# EAGLE design NixieTube_Daughterboard (EAGLE 9.6.2)
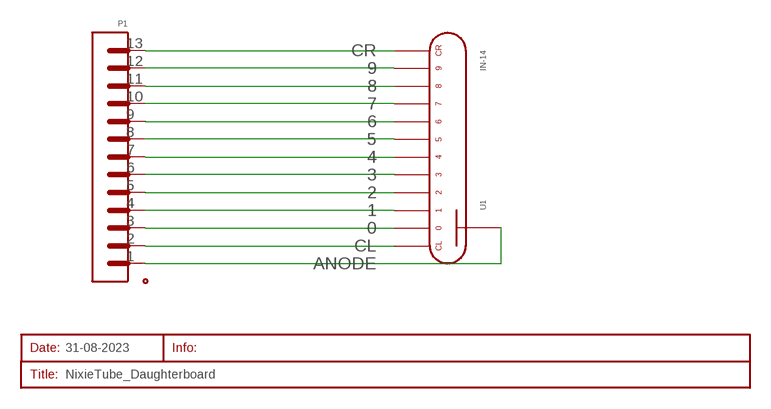
[diagram p0: schematic, sheet 1]

## Parts
P1  PORT_13-PIN_XH2.54  [XH2.54_13-PIN]
SCHEMATIC1  31-08-2023  SHEET  [SHEET]
U1  IN-14  NIXIE-TUBE_IN-14_TUBE  [NIXIE-TUBE_IN-14]

## Nets
0: P1.3 U1.1
1: P1.4 U1.2
2: P1.5 U1.3
3: P1.6 U1.4
4: P1.7 U1.5
5: P1.8 U1.6
6: P1.9 U1.7
7: P1.10 U1.8
8: P1.11 U1.9
9: P1.12 U1.0
ANODE: P1.1 U1.A(ANODE)
CL: P1.2 U1.C1
CR: P1.13 U1.C2

## Library data of the parts
P1 = myLibrary:PORT_13-PIN
SCHEMATIC1 = myLibrary:SHEET
U1 = myLibrary:NIXIE-TUBE_IN-14

## Board
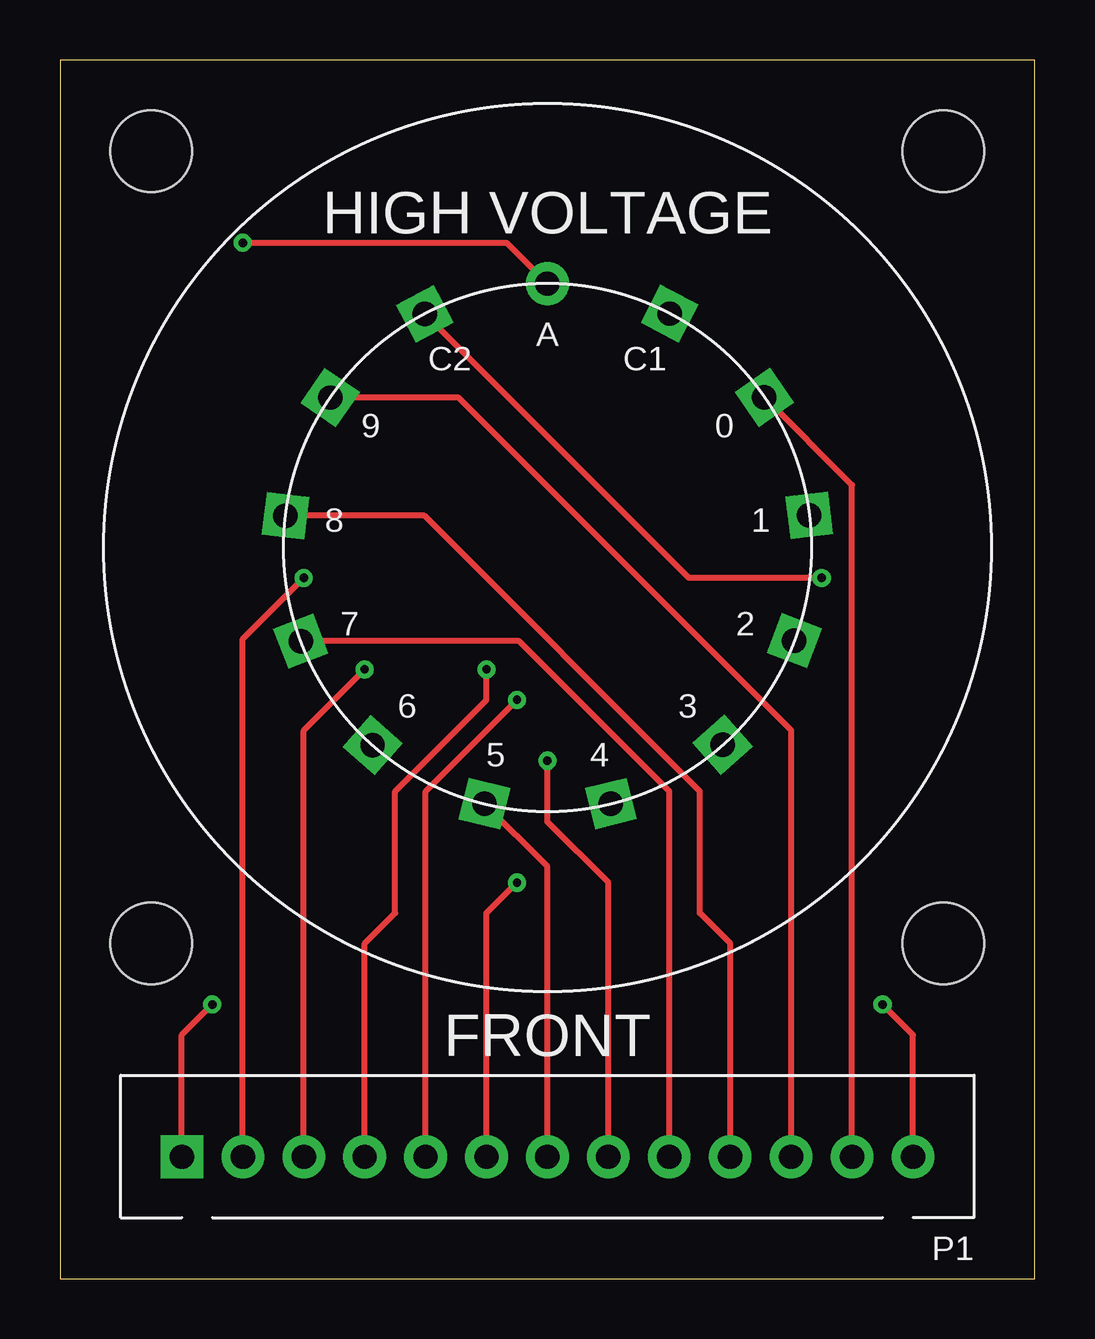
[diagram p1: board, top side]
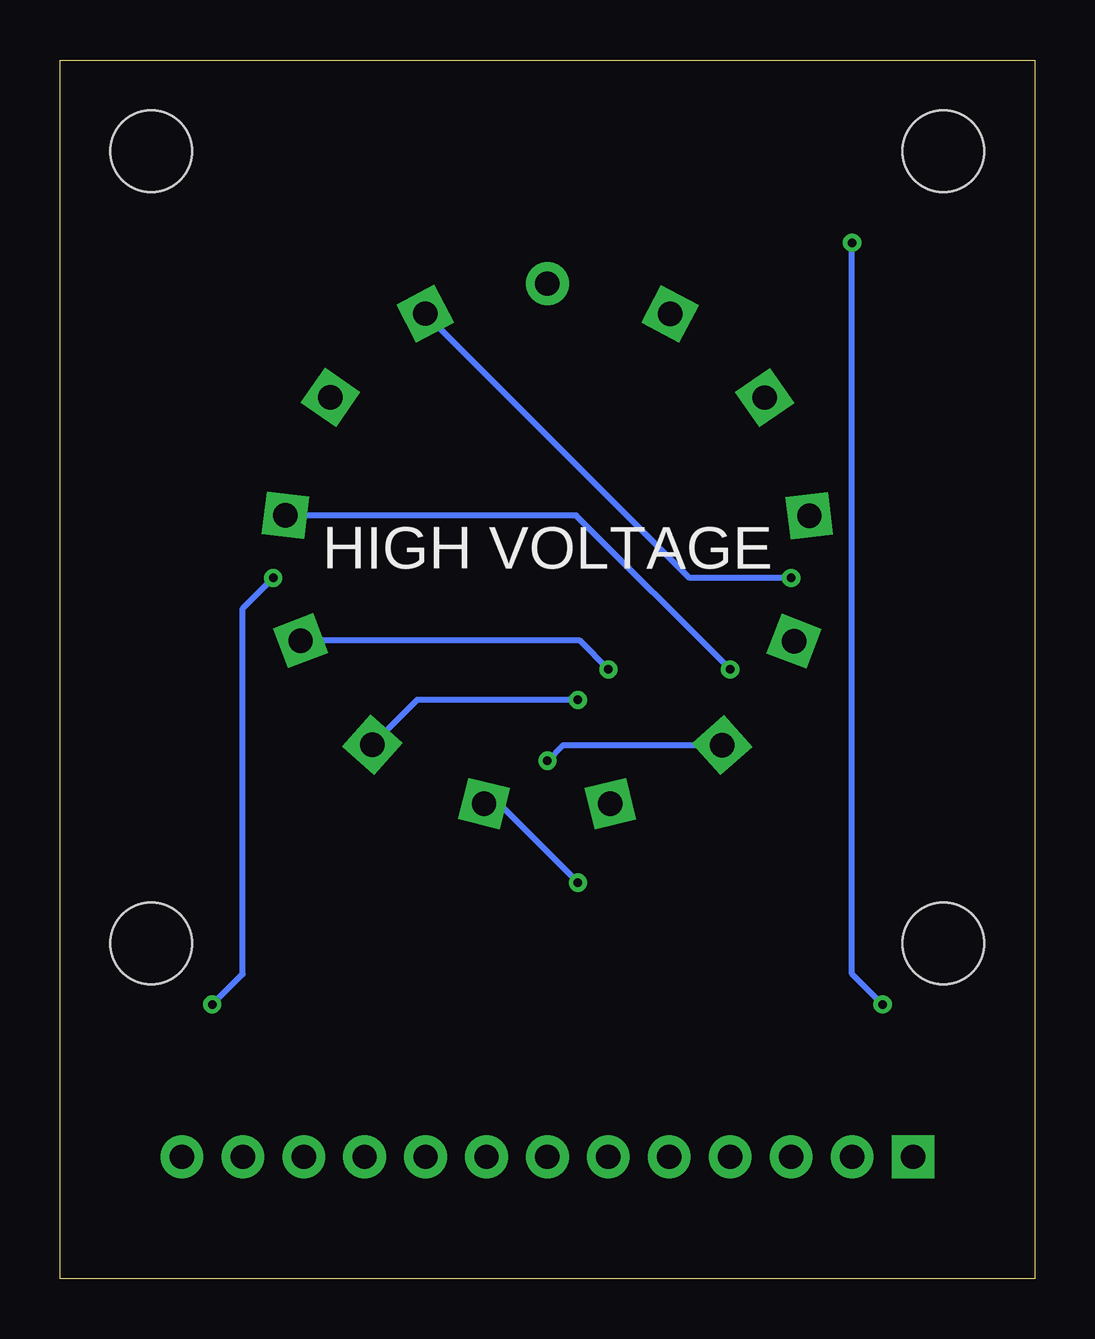
[diagram p2: board, bottom side, seen from below]

Size 40.64 x 50.8 mm. Coordinates in mm from the lower left corner, seen from the top.
Outline: 0,0 40.64,0 40.64,50.8 0,50.79 0,0
Copper layers (1*16): Top 0.035mm / dielectric 1.5mm / Bottom 0.035mm
Design rules "default *": minimum track width 6mil, minimum drill 0.35mm, track to track 12mil, track to pad 6mil, pad to pad 12mil, via to via 12mil, smd to smd 12mil, copper to edge 40mil, drill to drill 6mil, minimum pad ring 10mil, minimum via ring 8mil, stop-mask expansion 4mil, vias tented up to drill 0mil, thermal gap 10mil
Holes 3.4 mm at 3.81,13.97 36.83,13.97 36.83,46.99 3.81,46.99

### Footprints (pad centres in the part's own frame; a part is rotated, then mirrored left to right if it is on the bottom)
XH2.54_13-PIN = drill 1.016 pad 1.778 square: 1 -15.24,0 | drill 1.016 pad 1.778: 2 -12.7,0; 3 -10.16,0; 4 -7.62,0; 5 -5.08,0; 6 -2.54,0; 7 0,0; 8 2.54,0; 9 5.08,0; 10 7.62,0; 11 10.16,0; 12 12.7,0; 13 15.24,0
NIXIE-TUBE_IN-14 = drill 1.016 pad 1.778 square: 0 9.042,6.261; 1 10.916,1.34; 2 10.288,-3.888; 3 7.302,-8.224; 4 2.642,-10.676; 5 -2.623,-10.681; 6 -7.288,-8.237; 7 -10.281,-3.906; 8 -10.919,1.321; 9 -9.053,6.245; C1 5.095,9.747; C2 -5.112,9.738 | drill 1.016 pad 1.778: A 0,10.998

### Placement (x,y rotation side)
P1  20.32,5.08 0 top
SCHEMATIC1  1.27,1.27 0 top
U1  20.32,30.48 0 top

### Tracks (layer width: path | path; a pad name or v marks a point on that pad's centre or on a via)
0  (via drill 0.35)
  Top 0.254: v12.7,25.4 10.16,22.86 P1.3
  Bottom 0.254: v12.7,25.4 19.12,31.82 U1.1
1  (via drill 0.35)
  Top 0.254: P1.4 12.7,13.97 13.97,15.24 13.97,20.32 17.78,24.13 v17.78,25.4
  Bottom 0.254: v17.78,25.4 18.97,26.59 U1.2
2  (via drill 0.35)
  Top 0.254: P1.5 15.24,20.32 v19.05,24.13
  Bottom 0.254: v19.05,24.13 25.75,24.13 U1.3
3  (via drill 0.35)
  Top 0.254: P1.6 17.78,15.24 v19.05,16.51
  Bottom 0.254: v19.05,16.51 22.34,19.8 U1.4
4
  Top 0.254: U1.5 20.32,17.18 P1.7
5  (via drill 0.35)
  Top 0.254: v20.32,21.59 20.32,19.05 22.86,16.51 P1.8
  Bottom 0.254: v20.32,21.59 19.67,22.24 U1.6
6
  Top 0.254: U1.7 19.15,26.57 25.4,20.32 P1.9
7
  Top 0.254: P1.10 27.94,13.97 26.67,15.24 26.67,20.32 15.19,31.8 U1.8
8
  Top 0.254: U1.9 16.61,36.73 30.48,22.86 P1.11
9
  Top 0.254: U1.0 33.02,33.08 P1.12
ANODE  (via drill 0.35)
  Top 0.254: P1.1 5.08,10.16 v6.35,11.43 | v7.62,43.18 18.62,43.18 U1.A
  Bottom 0.254: v6.35,11.43 7.62,12.7 v7.62,43.18
CL  (via drill 0.35)
  Top 0.254: v10.16,29.21 7.62,26.67 P1.2
  Bottom 0.254: v10.16,29.21 14.4,29.21 U1.C1
CR  (via drill 0.35)
  Top 0.254: P1.13 35.56,10.16 v34.29,11.43 | v31.75,29.21 26.21,29.21 U1.C2
  Bottom 0.254: v34.29,11.43 33.02,12.7 33.02,27.94 v31.75,29.21

### Text on the board
tPlace: HIGH VOLTAGE
bPlace: HIGH VOLTAGE